# Altium schematic sheet LPEDT_revA1_bikeit_MCU_POWER_RESET.SchDoc: MCU Power and Reset Circuitry
size A3; Author: Dhruva Koley; DocumentNumber: 6; Revision: 1; SheetNumber: 3; SheetTotal: 4
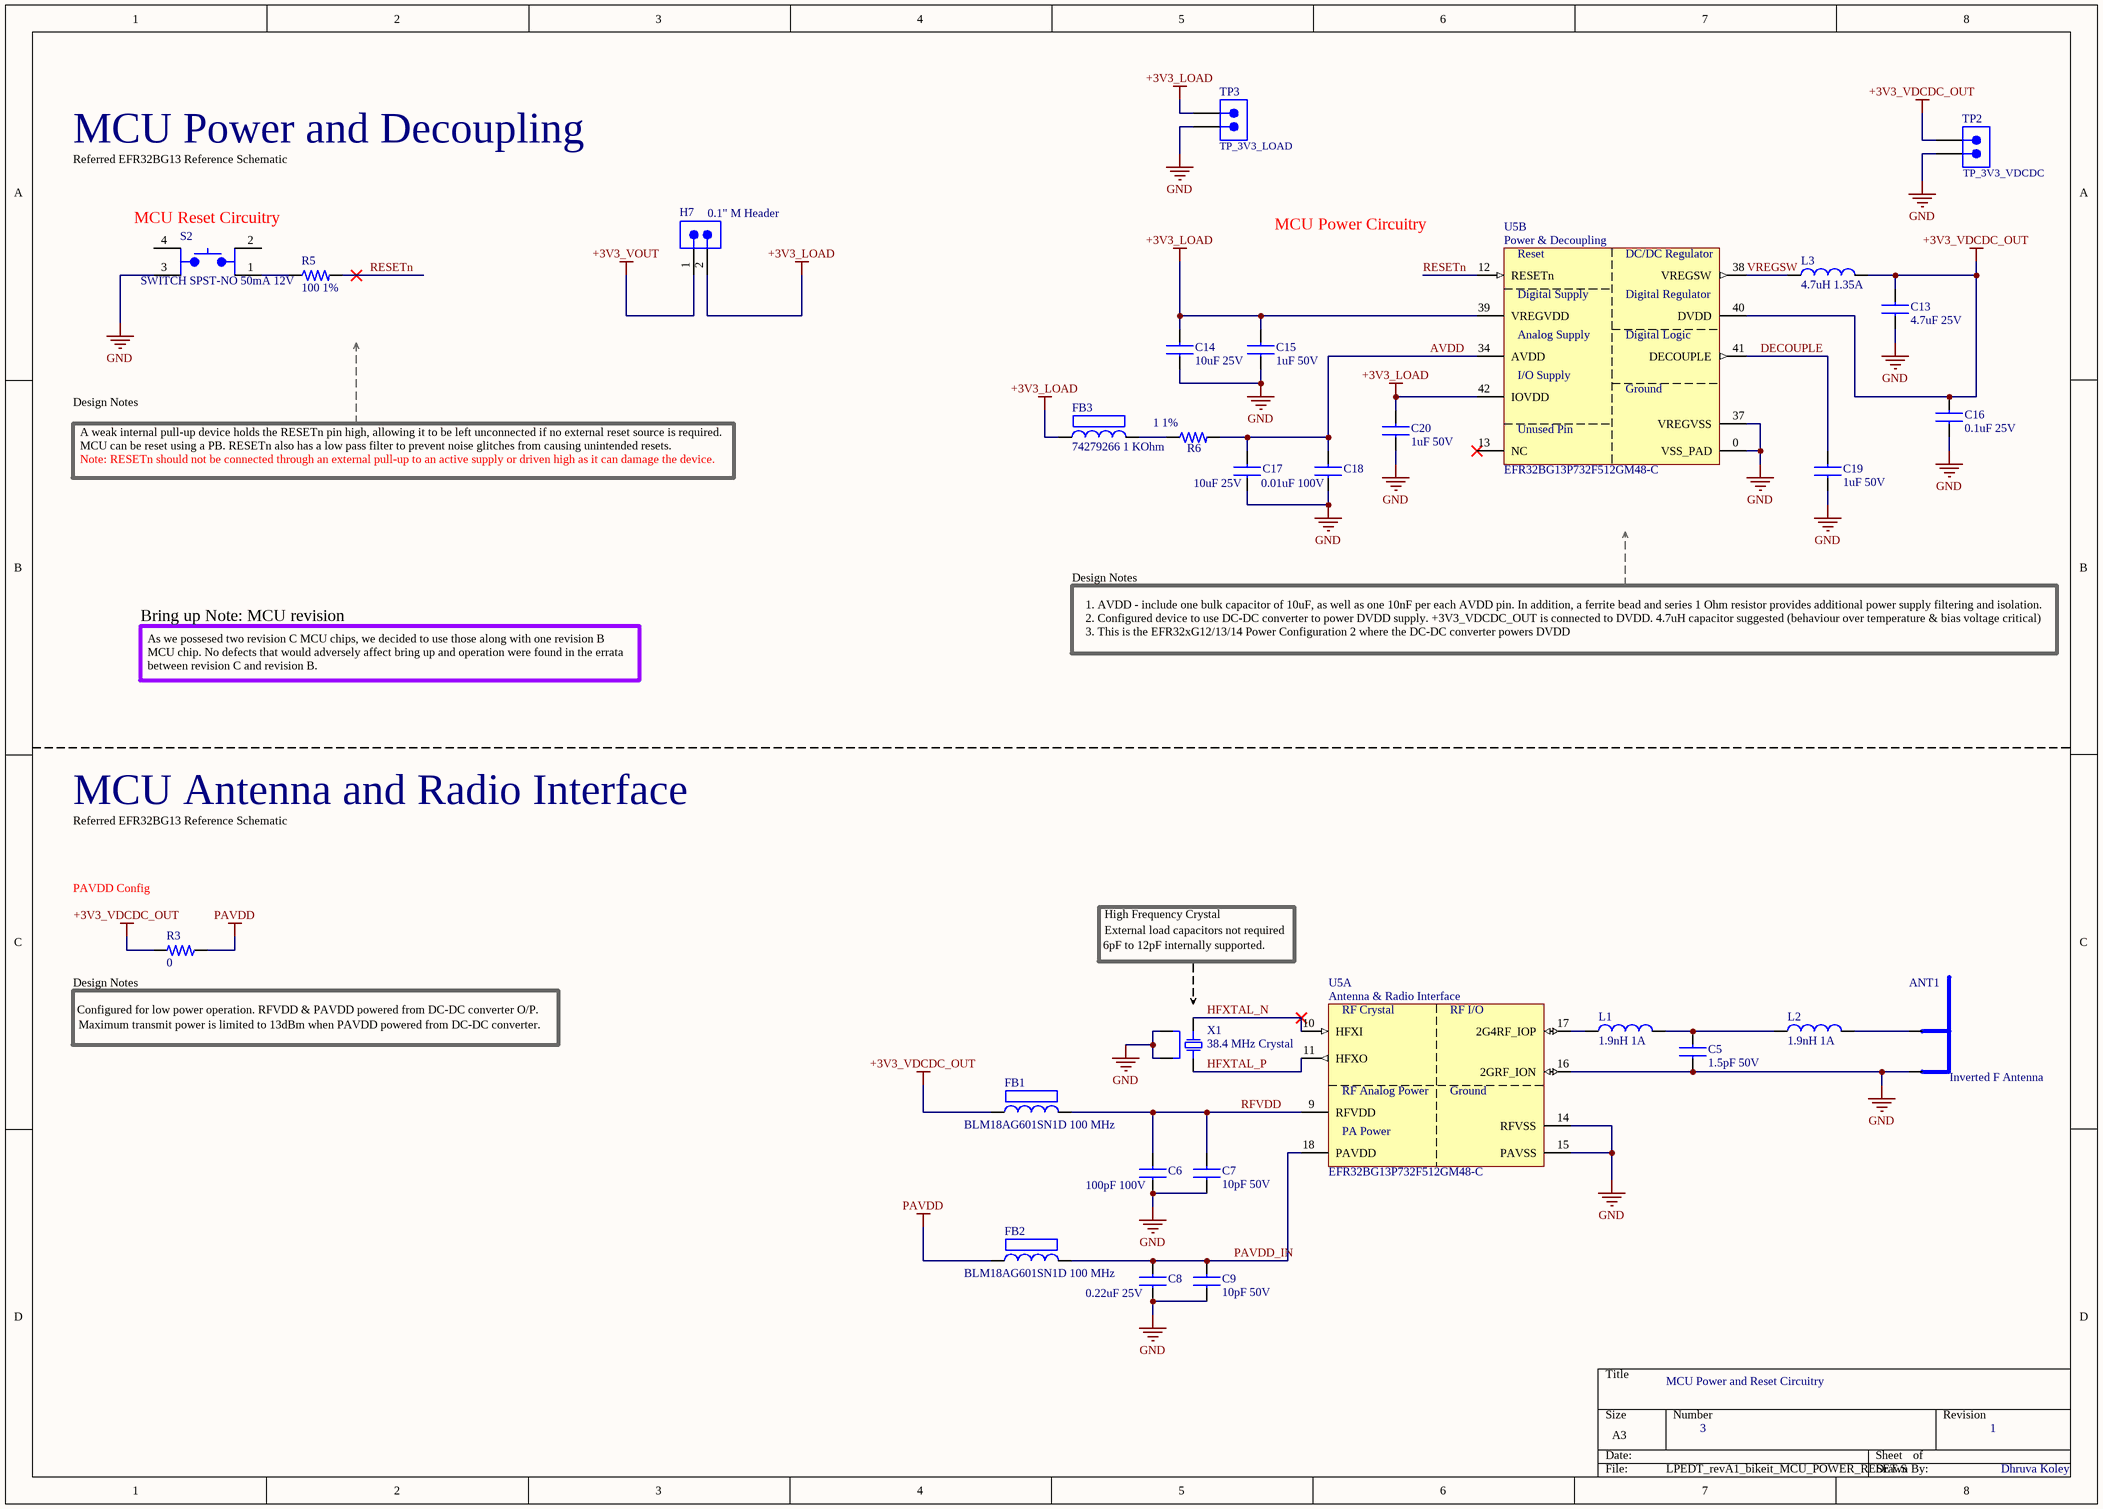
[diagram p0: LPEDT_revA1_bikeit_MCU_POWER_RESET.SchDoc]

## Parts
ANT1  Inverted F Antenna  [MIFA]  (net tie, no BOM)
C5  1.5pF 50V  [CAP_0403_1.00mm*0.50mm]
C6  100pF 100V  [CAP_0603_1.60mm*0.80mm]
C7  10pF 50V  [CAP_0603_1.60mm*0.80mm]
C8  0.22uF 25V  [CAP_0603_1.60mm*0.80mm]
C9  10pF 50V  [CAP_0603_1.60mm*0.80mm]
C13  4.7uF 25V  [CAP_0603_1.60mm*0.80mm]
C14  10uF 25V  [CAP_0805_2MM]
C15  1uF 50V  [CAP_0603_1.60mm*0.80mm]
C16  0.1uF 25V  [CAP_0603_1.60mm*0.80mm]
C17  10uF 25V  [CAP_0805_2MM]
C18  0.01uF 100V  [CAP_0603_1.60mm*0.80mm]
C19  1uF 50V  [CAP_0603_1.60mm*0.80mm]
C20  1uF 50V  [CAP_0603_1.60mm*0.80mm]
FB1  BLM18AG601SN1D 100 MHz  [FB_Chip2PinSM127P600-8N]
FB2  BLM18AG601SN1D 100 MHz  [FB_Chip2PinSM127P600-8N]
FB3  74279266 1 KOhm  [FB_0603_1.60mm*0.80mm]
H7  0.1" M Header  [2-PIN_MALE_HEADER_01-IN]
L1  1.9nH 1A  [IND_0402]
L2  1.9nH 1A  [IND_0402]
L3  4.7uH 1.35A  [IND_WE-TPC 2828]
R3  0  [RES_C1005X04N]
R5  100 1%  [RES_0603_1608X06]
R6  1 1%  [RES_0603_1608X06]
S2  SWITCH SPST-NO 50mA 12V  [SW_TL3305AF260QG]
TP2  TP_3V3_VDCDC  [TP10x_Probe]
TP3  TP_3V3_LOAD  [TP10x_Probe]
U5  EFR32BG13P732F512GM48-C  [MCU_QFN50P700X700X90_HS-49N]  (parts A,B of 3)
X1  38.4 MHz Crystal  [SMD_4 CRYSTAL]

## Nets
+3V3_LOAD: C14.1 C15.1 C20.1 FB3.1 H7.2 TP3.1(GND) U5.39(VREGVDD) U5.42(IOVDD)
+3V3_VDCDC_OUT: C13.1 C16.1 FB1.1 L3.2 R3.2 TP2.1(GND) U5.40(DVDD)
+3V3_VOUT: H7.1
GND: ANT1.GND C5.2 C6.2 C7.2 C8.2 C9.2 C13.2 C14.2 C15.2 C16.2 C17.2 C18.2 C19.2 C20.2 S2.3 TP2.2(SIG) TP3.2(SIG) U5.0(VSS_PAD) U5.14(RFVSS) U5.15(PAVSS) U5.16(2GRF_ION) U5.37(VREGVSS) X1.2(GND) X1.4(GND)
PAVDD: FB2.1 R3.1
AVDD: C17.1 C18.1 R6.2 U5.34(AVDD)
DECOUPLE: C19.1 U5.41(DECOUPLE)
HFXTAL_N: U5.10(HFXI) X1.3(HOT)
HFXTAL_P: U5.11(HFXO) X1.1(HOT)
PAVDD_IN: C8.1 C9.1 FB2.2 U5.18(PAVDD)
RESETn: R5.2 U5.12(RESETn)
RFVDD: C6.1 C7.1 FB1.2 U5.9(RFVDD)
VREGSW: L3.1 U5.38(VREGSW)
NetANT1_FEED: ANT1.FEED L2.2
NetC5_1: C5.1 L1.2 L2.1
NetFB3_2: FB3.2 R6.1
NetL1_1: L1.1 U5.17(2G4RF_IOP)
NetR5_1: R5.1 S2.1

Not connected (* = marked no-connect by the designer): S2 2 4; U5 13(NC)*

## Notes on the sheet
- MCU Power and Decoupling
- Referred EFR32BG13 Reference Schematic
- (near S2) MCU Reset Circuitry
- MCU Power Circuitry
- Design Notes
- A weak internal pull-up device holds the RESETn pin high, allowing it to be left unconnected if no external reset source is required.
- MCU can be reset using a PB. RESETn also has a low pass filter to prevent noise glitches from causing unintended resets.
- Note: RESETn should not be connected through an external pull-up to an active supply or driven high as it can damage the device.
- Bring up Note: MCU revision
- As we possesed two revision C MCU chips, we decided to use those along with one revision B
- 1. AVDD - include one bulk capacitor of 10uF, as well as one 10nF per each AVDD pin. In addition, a ferrite bead and series 1 Ohm resistor provides additional power supply filtering and isolation.
- 3. This is the EFR32xG12/13/14 Power Configuration 2 where the DC-DC converter powers DVDD
- 2. Configured device to use DC-DC converter to power DVDD supply. +3V3_VDCDC_OUT is connected to DVDD. 4.7uH capacitor suggested (behaviour over temperature & bias voltage critical)
- MCU chip. No defects that would adversely affect bring up and operation were found in the errata
- between revision C and revision B.
- MCU Antenna and Radio Interface
- PAVDD Config
- High Frequency Crystal
- (near R3) Design Notes
- 6pF to 12pF internally supported.
- External load capacitors not required
- Configured for low power operation. RFVDD & PAVDD powered from DC-DC converter O/P.
- Maximum transmit power is limited to 13dBm when PAVDD powered from DC-DC converter.
- (in symbol EFR32BG13P732F512GM48-C, part A) Antenna & Radio Interface; RF Crystal; RF I/O; RF Analog Power; Ground; PA Power
- (in symbol EFR32BG13P732F512GM48-C, part B) Power & Decoupling; Reset; DC/DC Regulator; Digital Supply; Digital Regulator; Analog Supply; Digital Logic; I/O Supply; Ground; Unused Pin

## Library data of the parts
ANT1 = Inverted F Antenna: Inverted F antenna for BT
C5 = 500R07S1R5BV4T: 1.5pF ±0.1pF 50V Ceramic Capacitor C0G, NP0 0402 (1005 Metric); Manufacturer: Johanson Technology Inc.; Manufacturer Part Number: 500R07S1R5BV4T; RoHS Compliant: Yes; Supplier 1: Digi-Key; Supplier Part Number 1: 712-1270-1-ND
C6 = GRM1885C2A101FA01D: Multilayer Ceramic Capacitors MLCC - SMD/SMT 100pF 100Volts C0G 0.01; Manufacturer: Murata; Tolerance: 1%; Manufacturer Part Number: GRM1885C2A101FA01D; RoHS: Yes; Category: Ceramic Capacitors; Stock 1: 40000; Pricing 1: 4000=0.03696, 8000=0.03511, 12000=0.03326, 28000=0.03142 (USD); Mount: Surface Mount; Case/Package: 0603; Case Code (Imperial): 0603; Case Code (Metric): 1608; Min Operating Temperature: -55°C; Max Operating Temperature: 125°C; Packaging: Tape and Reel; Package Quantity: 4000; Capacitance: 100pF; Voltage Rating: 100V; Dielectric: C0G; Voltage Rating (DC): 100V; Length: 1.6mm; Width: 0.031inch; Height: 0.8mm; Thickness: 0.035inch; Depth: 0.8mm; Radiation Hardening: No; ComponentLink1URL: https://datasheet.ciiva.com/29537/partnumbering-e-01-29537864.pdf?src-supplier=Digi-Key; ComponentLink1Description: https://datasheet.ciiva.com/29537/partnumbering-e-01-29537864.pdf?src-supplier=Digi-Key; Supplier 1: Digi-Key; Supplier Part Number 1: 490-14623-1-ND
C7 C9 = GRM1885C1H100FA01D: Cap Ceramic 10pF 50V C0G 1% SMD 0603 125C T/R; Manufacturer: Murata; Temperature Coefficient: 30ppm/°C; Supplier 1: Digi-Key; Manufacturer Part Number: GRM1885C1H100FA01D; RoHS: Yes; Category: Ceramic Capacitors; Stock 1: 160; Pricing 1: 1=0.15000, 10=0.11000, 50=0.06240, 100=0.05170 (USD); Mount: Surface Mount; Case/Package: 0603; Case Code (Metric): 1608; Case Code (Imperial): 0603; Material: Ceramic; Min Operating Temperature: -55°C; Max Operating Temperature: 125°C; Packaging: Tape and Reel; Capacitance: 10pF; Tolerance: 1%; Voltage Rating: 50V; Package Quantity: 4000; Voltage Rating (DC): 50V; Dielectric: C0G; Termination: SMD/SMT; Voltage: 50V; Series: GRM; Construction: Flat; Length: 1.6mm; Width: 0.8mm; Height: 0.8mm; Thickness: 0.035inch; Depth: 0.8mm; Radiation Hardening: No; Lead Free: Lead Free; RoHS Compliant: Yes; ComponentLink1URL: https://datasheet.ciiva.com/2989/c02e-2989424.pdf?src-supplier=Avnet; ComponentLink1Description: https://datasheet.ciiva.com/2989/c02e-2989424.pdf?src-supplier=Avnet; ComponentLink2URL: https://datasheet.ciiva.com/166/partnumbering-e-01-166098.pdf?src-supplier=Digi-Key; ComponentLink2Description: https://datasheet.ciiva.com/166/partnumbering-e-01-166098.pdf?src-supplier=Digi-Key; ComponentLink3URL: https://datasheet.ciiva.com/45259/partnumbering-e-01-45259517.pdf?src-supplier=Digi-Key; ComponentLink3Description: https://datasheet.ciiva.com/45259/partnumbering-e-01-45259517.pdf?src-supplier=Digi-Key; ComponentLink4URL: https://datasheet.ciiva.com/17453/c02e-17453134.pdf?src-supplier=Avnet+Europe; ComponentLink4Description: https://datasheet.ciiva.com/17453/c02e-17453134.pdf?src-supplier=Avnet+Europe; Supplier Part Number 1: 490-9713-1-ND
C8 = GRM188R71E224KA88D: Capacitor 220 nF 25 VDC PU=4000 ST, GRM188R71E224KA88D, Murata; Material: Ceramic; Capacitance: 220nF; Tolerance: 10%; Dielectric: X7R; Voltage: 50V; Supplier 1: Digi-Key; Manufacturer: Murata; Manufacturer Part Number: GRM188R71E224KA88D; RoHS: Yes; Category: Ceramic Capacitors; Stock 1: 208118; Pricing 1: 1=0.20000, 10=0.13700, 50=0.08240, 100=0.06960, 500=0.04760, 1000=0.04210 (USD); Mount: Surface Mount; Case/Package: 0603; Number of Pins: 2; Case Code (Imperial): 0603; Case Code (Metric): 1608; Min Operating Temperature: -55°C; Max Operating Temperature: 125°C; Voltage Rating: 25V; Voltage Rating (DC): 25V; Packaging: Tape and Reel; Package Quantity: 1; Termination: SMD/SMT; Length: 1.6mm; Width: 0.8mm; Height: 0.8mm; Thickness: 0.035inch; Depth: 0.8mm; Radiation Hardening: No; REACH SVHC: No SVHC; Lead Free: Lead Free; RoHS Compliant: Yes; ComponentLink1URL: https://datasheet.ciiva.com/5411/product-5411362.pdf?src-supplier=Mouser; ComponentLink1Description: https://datasheet.ciiva.com/5411/product-5411362.pdf?src-supplier=Mouser; ComponentLink2URL: https://datasheet.ciiva.com/11786/0900766b807a1cab-11786308.pdf?src-supplier=RSComponents; ComponentLink2Description: https://datasheet.ciiva.com/11786/0900766b807a1cab-11786308.pdf?src-supplier=RSComponents; ComponentLink3URL: https://datasheet.ciiva.com/6068/1784408-6068393.pdf?src-supplier=Farnell; ComponentLink3Description: https://datasheet.ciiva.com/6068/1784408-6068393.pdf?src-supplier=Farnell; ComponentLink4URL: https://datasheet.ciiva.com/133/grm188r71e224ka88-01-133883.pdf?src-supplier=Digi-Key; ComponentLink4Description: https://datasheet.ciiva.com/133/grm188r71e224ka88-01-133883.pdf?src-supplier=Digi-Key; ComponentLink5URL: https://datasheet.ciiva.com/133/grm188r71e224ka88-01-133884.pdf?src-supplier=Digi-Key; ComponentLink5Description: https://datasheet.ciiva.com/133/grm188r71e224ka88-01-133884.pdf?src-supplier=Digi-Key; ComponentLink6URL: https://datasheet.ciiva.com/3777/1531grm188r71e224ka8823-3777688.pdf?src-supplier=Arrow+Electronics; ComponentLink6Description: https://datasheet.ciiva.com/3777/1531grm188r71e224ka8823-3777688.pdf?src-supplier=Arrow+Electronics; ComponentLink7URL: https://datasheet.ciiva.com/29202/451619-da-01-en-vs-kondensator-0603-29202002.pdf?src-supplier=Conrad; ComponentLink7Description: https://datasheet.ciiva.com/29202/451619-da-01-en-vs-kondensator-0603-29202002.pdf?src-supplier=Conrad; ComponentLink8URL: https://datasheet.ciiva.com/14116/nmgrm-data-en-14116629.pdf?src-supplier=Distrelec; ComponentLink8Description: https://datasheet.ciiva.com/14116/nmgrm-data-en-14116629.pdf?src-supplier=Distrelec; ComponentLink9URL: https://datasheet.ciiva.com/16425/product-16425866.pdf?src-supplier=Future+Electronics; ComponentLink9Description: https://datasheet.ciiva.com/16425/product-16425866.pdf?src-supplier=Future+Electronics; ComponentLink10URL: https://datasheet.ciiva.com/22703/1784408-22703338.pdf?src-supplier=Element14; ComponentLink10Description: https://datasheet.ciiva.com/22703/1784408-22703338.pdf?src-supplier=Element14; ComponentLink11URL: https://datasheet.ciiva.com/7937/1784408-7937645.pdf?src-supplier=Element14; ComponentLink11Description: https://datasheet.ciiva.com/7937/1784408-7937645.pdf?src-supplier=Element14; ComponentLink12URL: https://datasheet.ciiva.com/48436/nmgrm-data-en-48436687.pdf?src-supplier=Distrelec; ComponentLink12Description: https://datasheet.ciiva.com/48436/nmgrm-data-en-48436687.pdf?src-supplier=Distrelec; Supplier Part Number 1: 490-3290-1-ND
C13 = GRM188R61E475KE11D: Cap Ceramic 0603 4.7 uF 25 V ±10 % Tolerance X5R SMT Multilayer Ceramic Capacitor; Manufacturer: Murata; Tolerance: 10%; Supplier 1: Digi-Key; Manufacturer Part Number: GRM188R61E475KE11D; RoHS: Yes; Category: Ceramic Capacitors; Stock 1: 307528; Pricing 1: 1=0.36000, 10=0.24700, 50=0.17280, 100=0.14820, 500=0.11112, 1000=0.09384 (USD); Mount: Surface Mount; Case/Package: 0603; Case Code (Metric): 1608; Case Code (Imperial): 0603; Material: Ceramic; Min Operating Temperature: -55°C; Max Operating Temperature: 85°C; Package Quantity: 4000; Packaging: Cut Tape; Capacitance: 4.7uF; Voltage Rating: 25V; Dielectric: X5R; Voltage: 25V; Voltage Rating (DC): 25V; Series: GRM; Length: 1.6mm; Width: 0.031inch; Height: 0.8mm; Thickness: 0.031inch; Depth: 0.8mm; REACH SVHC: No SVHC; Lead Free: Lead Free; RoHS Compliant: Yes; ComponentLink1URL: https://datasheet.ciiva.com/46444/1769893-46444982.pdf?src-supplier=Element14; ComponentLink1Description: https://datasheet.ciiva.com/46444/1769893-46444982.pdf?src-supplier=Element14; ComponentLink2URL: https://datasheet.ciiva.com/46444/1769893-46444983.pdf?src-supplier=Element14; ComponentLink2Description: https://datasheet.ciiva.com/46444/1769893-46444983.pdf?src-supplier=Element14; ComponentLink3URL: https://datasheet.ciiva.com/14891/partnumbering-e-01-14891103.pdf?src-supplier=Digi-Key; ComponentLink3Description: https://datasheet.ciiva.com/14891/partnumbering-e-01-14891103.pdf?src-supplier=Digi-Key; ComponentLink4URL: https://datasheet.ciiva.com/14891/partnumbering-e-01-14891102.pdf?src-supplier=Digi-Key; ComponentLink4Description: https://datasheet.ciiva.com/14891/partnumbering-e-01-14891102.pdf?src-supplier=Digi-Key; Supplier Part Number 1: 490-7203-1-ND
C14 C17 = GRM21BR61E106KA73K: CAP CER 10UF 25V X5R 0805; Manufacturer: Murata; Tolerance: 10%; Manufacturer Part Number: GRM21BR61E106KA73K; RoHS: Yes; Category: Ceramic Capacitors; Stock 1: 79269; Pricing 1: 1=0.23000, 10=0.15700, 50=0.09400, 100=0.07940, 500=0.05434, 1000=0.04807, 2500=0.04598, 5000=0.04180 (USD); Mount: Surface Mount; Case/Package: 0805; Weight: 0.000335oz; Min Operating Temperature: -55°C; Max Operating Temperature: 85°C; Packaging: Tape and Reel; Capacitance: 10uF; Voltage Rating: 25V; Package Quantity: 10000; Dielectric: X5R; Voltage Rating (DC): 25V; Length: 0.079inch; Width: 0.049inch; Thickness: 0.055inch; RoHS Compliant: Yes; ComponentLink1URL: http://www.mouser.com/ds/2/281/c02e-2905.pdf?src-supplier=Mouser; ComponentLink1Description: http://www.mouser.com/ds/2/281/c02e-2905.pdf?src-supplier=Mouser; ComponentLink2URL: http://search.murata.co.jp/Ceramy/image/img/A01X/G101/ENG/GRM21BR61E106KA73-01.pdf?src-supplier=Digi-Key; ComponentLink2Description: http://search.murata.co.jp/Ceramy/image/img/A01X/G101/ENG/GRM21BR61E106KA73-01.pdf?src-supplier=Digi-Key; ComponentLink3URL: https://search.murata.co.jp/Ceramy/image/img/A01X/G101/ENG/GRM21BR61E106KA73-01.pdf?src-supplier=Digi-Key; ComponentLink3Description: https://search.murata.co.jp/Ceramy/image/img/A01X/G101/ENG/GRM21BR61E106KA73-01.pdf?src-supplier=Digi-Key; Supplier 1: Digi-Key; Supplier Part Number 1: 490-16824-1-ND
C15 C19 C20 = GRT188R61H105KE13D: CAP, MLCC, AEC-Q200, X5R, 1uF, 50V, 0603; Manufacturer: Murata; Tolerance: 10%; Supplier 1: Digi-Key; Manufacturer Part Number: GRT188R61H105KE13D; RoHS: Yes; Category: Ceramic Capacitors; Stock 1: 645268; Pricing 1: 1=0.26000, 10=0.17900, 50=0.10720, 100=0.09060, 500=0.06198, 1000=0.05483 (USD); Mount: Surface Mount; Case/Package: 0603; Case Code (Metric): 1608; Case Code (Imperial): 0603; Min Operating Temperature: -55°C; Max Operating Temperature: 85°C; Packaging: Tape and Reel; Capacitance: 1uF; Voltage Rating: 50V; Dielectric: X5R; Voltage Rating (DC): 50V; Length: 0.063inch; Width: 0.031inch; Thickness: 0.035inch; Ratings: AEC-Q200; RoHS Compliant: Yes; ComponentLink1URL: http://www.farnell.com/datasheets/2165959.pdf?src-supplier=Farnell; ComponentLink1Description: http://www.farnell.com/datasheets/2165959.pdf?src-supplier=Farnell; ComponentLink2URL: http://search.murata.co.jp/Ceramy/image/img/A01X/G101/ENG/GRT188R61H105KE13-01.pdf?src-supplier=Digi-Key; ComponentLink2Description: http://search.murata.co.jp/Ceramy/image/img/A01X/G101/ENG/GRT188R61H105KE13-01.pdf?src-supplier=Digi-Key; ComponentLink3URL: https://search.murata.co.jp/Ceramy/image/img/A01X/G101/ENG/GRT188R61H105KE13-01.pdf?src-supplier=Digi-Key; ComponentLink3Description: https://search.murata.co.jp/Ceramy/image/img/A01X/G101/ENG/GRT188R61H105KE13-01.pdf?src-supplier=Digi-Key; ComponentLink4URL: http://www.farnell.com/datasheets/2165959.pdf?src-supplier=Newark; ComponentLink4Description: http://www.farnell.com/datasheets/2165959.pdf?src-supplier=Newark; Supplier Part Number 1: 490-12330-1-ND
C16 = GCJ188R71E104KA12D: CAP CER 0.1UF 25V X7R 0603; Manufacturer: Murata; Capacitance: 100nF; Tolerance: 10%; Supplier 1: Mouser; Manufacturer Part Number: GCJ188R71E104KA12D; RoHS: Yes; Category: Ceramic Capacitors; Stock 1: 1672; Pricing 1: 1=0.21000, 10=0.14900, 50=0.08480, 100=0.07030, 500=0.04928, 1000=0.04080 (USD); Mount: Surface Mount; Case/Package: 0603; Case Code (Imperial): 0603; Case Code (Metric): 1608; Min Operating Temperature: -55°C; Max Operating Temperature: 125°C; Features: Soft Termination; Packaging: Tape and Reel; Voltage Rating: 25V; Ratings: AEC-Q200; RoHS Compliant: Yes; ComponentLink1URL: http://search.murata.co.jp/Ceramy/image/img/A01X/G101/ENG/GCJ188R71E104KA12-01.pdf?src-supplier=Digi-Key; ComponentLink1Description: http://search.murata.co.jp/Ceramy/image/img/A01X/G101/ENG/GCJ188R71E104KA12-01.pdf?src-supplier=Digi-Key; Supplier Part Number 1: 81-GCJ188R71E104KA2D
C18 = GCM188R72A103KA37D: Multilayer Ceramic Capacitor, AEC-Q200 GCM Series, 0.01 F, 10%, X7R, 100 V RoHS Compliant: Yes; Manufacturer: Murata; Manufacturer Part Number: GCM188R72A103KA37J; Capacitance: 10nF; Supplier 1: Digi-Key; RoHS: Yes; Category: Ceramic Capacitors; Stock 1: 112779; Pricing 1: 1=0.10000, 10=0.07400, 50=0.04060, 100=0.03310, 500=0.02364, 1000=0.01857 (USD); Mount: Surface Mount; Case/Package: 0603; Case Code (Imperial): 0603; Case Code (Metric): 1608; Min Operating Temperature: -55°C; Max Operating Temperature: 125°C; Tolerance: 10%; Voltage Rating: 100V; Packaging: Tape and Reel; Voltage Rating (DC): 100V; Package Quantity: 1; Dielectric: X7R; Termination: SMD/SMT; Voltage: 100V; Series: GCM; Construction: Flat; Length: 1.6mm; Width: 0.8mm; Height: 0.8mm; Thickness: 0.035inch; Depth: 0.8mm; Ratings: AEC-Q200; Radiation Hardening: No; REACH SVHC: No SVHC; Lead Free: Lead Free; RoHS Compliant: Yes; ComponentLink1URL: https://datasheet.ciiva.com/132/product-132907.pdf?src-supplier=Digi-Key; ComponentLink1Description: https://datasheet.ciiva.com/132/product-132907.pdf?src-supplier=Digi-Key; ComponentLink2URL: https://datasheet.ciiva.com/132/product-132909.pdf?src-supplier=Digi-Key; ComponentLink2Description: https://datasheet.ciiva.com/132/product-132909.pdf?src-supplier=Digi-Key; ComponentLink3URL: https://datasheet.ciiva.com/16497/product-16497251.pdf?src-supplier=Future+Electronics; ComponentLink3Description: https://datasheet.ciiva.com/16497/product-16497251.pdf?src-supplier=Future+Electronics; ComponentLink4URL: https://datasheet.ciiva.com/18183/getdatasheetpartid-178890-18183651.pdf?src-supplier=Verical; ComponentLink4Description: https://datasheet.ciiva.com/18183/getdatasheetpartid-178890-18183651.pdf?src-supplier=Verical; ComponentLink5URL: https://datasheet.ciiva.com/132/product-132908.pdf?src-supplier=Digi-Key; ComponentLink5Description: https://datasheet.ciiva.com/132/product-132908.pdf?src-supplier=Digi-Key; ComponentLink6URL: https://datasheet.ciiva.com/11786/0900766b80ef92d0-11786108.pdf?src-supplier=RSComponents; ComponentLink6Description: https://datasheet.ciiva.com/11786/0900766b80ef92d0-11786108.pdf?src-supplier=RSComponents; ComponentLink7URL: https://datasheet.ciiva.com/11619/product-11619719.pdf?src-supplier=Avnet; ComponentLink7Description: https://datasheet.ciiva.com/11619/product-11619719.pdf?src-supplier=Avnet; Supplier Part Number 1: 490-8028-1-ND
FB1 FB2 = BLM18AG601SN1D: Ferrite Bead, 0603 / 1608, 600 ohm, 500 mA, Série BLM18A, 0.38 ohm, ± 25%; Manufacturer: Murata; Material: Steel,Ferrite; Frequency: 100MHz; Impedance: 600R; Max Current Rating: 500mA; Number of Lines: 1; DC Resistance (DCR): 380mR; Shielding: Unshielded; Supplier 1: Digi-Key; Manufacturer Part Number: BLM18AG601SN1D; RoHS: Yes; Category: Inductors; Stock 1: 826617; Pricing 1: 1=0.10000, 10=0.07200, 25=0.06560, 50=0.05900, 100=0.04320, 250=0.03144, 500=0.02882, 1000=0.02489 (USD); Case/Package: 0603; Number of Pins: 2; Core Material: Ferrite; Case Code (Metric): 1608; Case Code (Imperial): 0603; Weight: 7.1E-05oz; Min Operating Temperature: -55°C; Max Operating Temperature: 125°C; Package Quantity: 1; Packaging: Tape and Reel; Tolerance: 25%; Current Rating: 500mA; Termination: SMD/SMT; Max DC Current: 500mA; Test Frequency: 100MHz; DC Current: 500mA; Number of Circuits: 1; Length: 1.6mm; Width: 0.8mm; Height: 0.8mm; Depth: 0.8mm; Radiation Hardening: No; RoHS Compliant: Yes; Lead Free: Lead Free; REACH SVHC: No SVHC; Military Standard: Not; ComponentLink1URL: https://datasheet.ciiva.com/19460/1844766-19460213.pdf?src-supplier=Jameco; ComponentLink1Description: https://datasheet.ciiva.com/19460/1844766-19460213.pdf?src-supplier=Jameco; ComponentLink2URL: https://datasheet.ciiva.com/29347/442309-da-01-en-chip-drossel-0603-600r-500ma-1-6x0-8mm-29347900.pdf?src-supplier=Conrad; ComponentLink2Description: https://datasheet.ciiva.com/29347/442309-da-01-en-chip-drossel-0603-600r-500ma-1-6x0-8mm-29347900.pdf?src-supplier=Conrad; ComponentLink3URL: https://datasheet.ciiva.com/41449/001172228-da-01-en-drossel-0603-600r-1-6x0-8mm-4000st-41449517.pdf?src-supplier=Conrad; ComponentLink3Description: https://datasheet.ciiva.com/41449/001172228-da-01-en-drossel-0603-600r-1-6x0-8mm-4000st-41449517.pdf?src-supplier=Conrad; ComponentLink4URL: https://datasheet.ciiva.com/1012/l0110s0100blm18a-1012017.pdf?src-supplier=Digi-Key; ComponentLink4Description: https://datasheet.ciiva.com/1012/l0110s0100blm18a-1012017.pdf?src-supplier=Digi-Key; ComponentLink5URL: https://datasheet.ciiva.com/1012/l0110s0100blm18a-1012018.pdf?src-supplier=Digi-Key; ComponentLink5Description: https://datasheet.ciiva.com/1012/l0110s0100blm18a-1012018.pdf?src-supplier=Digi-Key; ComponentLink6URL: https://datasheet.ciiva.com/1012/l0110s0100blm18a-1012019.pdf?src-supplier=Digi-Key; ComponentLink6Description: https://datasheet.ciiva.com/1012/l0110s0100blm18a-1012019.pdf?src-supplier=Digi-Key; ComponentLink7URL: https://datasheet.ciiva.com/1466/1756147-1466933.pdf?src-supplier=Element14; ComponentLink7Description: https://datasheet.ciiva.com/1466/1756147-1466933.pdf?src-supplier=Element14; ComponentLink8URL: https://datasheet.ciiva.com/1466/1756147-1466934.pdf?src-supplier=Element14; ComponentLink8Description: https://datasheet.ciiva.com/1466/1756147-1466934.pdf?src-supplier=Element14; ComponentLink9URL: https://datasheet.ciiva.com/16210/l0110s0100blm18a-16210006.pdf?src-supplier=Future+Electronics; ComponentLink9Description: https://datasheet.ciiva.com/16210/l0110s0100blm18a-16210006.pdf?src-supplier=Future+Electronics; ComponentLink10URL: https://datasheet.ciiva.com/3081/l0110s0100blm18a-3081613.pdf?src-supplier=Avnet; ComponentLink10Description: https://datasheet.ciiva.com/3081/l0110s0100blm18a-3081613.pdf?src-supplier=Avnet; Supplier Part Number 1: 490-1014-1-ND
FB3 = 74279266: Ferrite Bead, 0603 [1608 Metric], 1 kohm, 200 mA, WE-CBF Series, 0.6 ohm, ± 25%; Manufacturer: Wurth Electronics; Impedance: 1kR; Current Rating: 200mA; DC Resistance (DCR): 600mR; Test Frequency: 100MHz; Inductance: 1.8nH; Shielding: Unshielded; Number of Lines: 1; Supplier 1: Digi-Key; Manufacturer Part Number: 74279266; RoHS: Yes; Category: Ferrite Beads and Chips; Stock 1: 55585; Pricing 1: 1=0.17000, 50=0.16800, 100=0.15500, 500=0.14800, 1000=0.14100, 2000=0.13400 (USD); Case/Package: SMD/SMT; Case Code (Metric): 1608; Case Code (Imperial): 0603; Core Material: Ferrite; Min Operating Temperature: -55°C; Max Operating Temperature: 125°C; Tolerance: 25%; Packaging: Tape and Reel; Series: WE-CBF; Max DC Current: 200mA; Termination: SMD/SMT; Max Current Rating: 200mA; Length: 1.6mm; Width: 0.8mm; Height: 0.8mm; Depth: 0.8mm; REACH SVHC: Unknown; Lead Free: Lead Free; RoHS Compliant: Yes; ComponentLink1URL: https://datasheet.ciiva.com/14634/0900766b801ef1d0-14634816.pdf?src-supplier=Allied+Electronics; ComponentLink1Description: https://datasheet.ciiva.com/14634/0900766b801ef1d0-14634816.pdf?src-supplier=Allied+Electronics; ComponentLink2URL: https://datasheet.ciiva.com/23763/74279266-23763009.pdf?src-supplier=Newark; ComponentLink2Description: https://datasheet.ciiva.com/23763/74279266-23763009.pdf?src-supplier=Newark; ComponentLink3URL: https://datasheet.ciiva.com/11799/0900766b801ef1d0-11799352.pdf?src-supplier=RSComponents; ComponentLink3Description: https://datasheet.ciiva.com/11799/0900766b801ef1d0-11799352.pdf?src-supplier=RSComponents; ComponentLink4URL: https://datasheet.ciiva.com/14971/74279266-14971192.pdf?src-supplier=Digi-Key; ComponentLink4Description: https://datasheet.ciiva.com/14971/74279266-14971192.pdf?src-supplier=Digi-Key; ComponentLink5URL: https://datasheet.ciiva.com/12395/74279266-221135-12395453.pdf?src-supplier=Mouser; ComponentLink5Description: https://datasheet.ciiva.com/12395/74279266-221135-12395453.pdf?src-supplier=Mouser; ComponentLink6URL: https://datasheet.ciiva.com/1466/1705901-1466509.pdf?src-supplier=Element14; ComponentLink6Description: https://datasheet.ciiva.com/1466/1705901-1466509.pdf?src-supplier=Element14; ComponentLink7URL: https://datasheet.ciiva.com/22711/1705901-22711422.pdf?src-supplier=Element14; ComponentLink7Description: https://datasheet.ciiva.com/22711/1705901-22711422.pdf?src-supplier=Element14; ComponentLink8URL: https://datasheet.ciiva.com/48698/001087059-da-01-ml-we-cbf-smd-ferrit-74279266-de-en-48698427.pdf?src-supplier=Conrad; ComponentLink8Description: https://datasheet.ciiva.com/48698/001087059-da-01-ml-we-cbf-smd-ferrit-74279266-de-en-48698427.pdf?src-supplier=Conrad; Supplier Part Number 1: 732-4484-1-ND
H7 = PRPC002SAAN-RC: CONN HEADER VERT 2POS 2.54MM; Manufacturer: Sullins; Connector Type: Header, Unshrouded, Breakaway; Number of Positions: 2; Number of Positions Loaded: All; Pitch: 0.100" (2.54mm); Online Catalog: 0.100" (2.54mm) Pitch Connector Headers; Other Names: S9510E-02  S9510E-02-ND; Supplier 1: Digi-Key; Manufacturer Part Number: PRPC002SAAN-RC; Stock 1: 42739; Pricing 1: 1=0.08, 10=0.073, 25=0.054, 50=0.0464, 100=0.0449, 250=0.0387, 500=0.0372 (USD); Standard Package: 1; Category: Connectors, Interconnects; Family: Rectangular Connectors - Headers, Male Pins; Series: -; Packaging: Bulk; Contact Type: Male Pin; Number of Rows: 1; Row Spacing: -; Contact Mating Length: 0.230" (5.84mm); Mounting Type: Through Hole; Termination: Solder; Fastening Type: -; Features: -; Contact Finish: Gold; Contact Finish Thickness: Flash; Color: Black; ComponentLink1URL: https://media.digikey.com/PDF/Data%20Sheets/Sullins%20PDFs/xRxCzzzSxxN-RC_ST_11635-B.pdf?src-supplier=Digi-Key; ComponentLink1Description: https://media.digikey.com/PDF/Data%20Sheets/Sullins%20PDFs/xRxCzzzSxxN-RC_ST_11635-B.pdf?src-supplier=Digi-Key; Supplier Part Number 1: S1011EC-02-ND
L1 L2 = LQG15WZ1N9S02D: 1.9nH Unshielded Multilayer Inductor 1A 50mOhm Max 0402 (1005 Metric); RoHS: No; Category: Fixed Inductors; Supplier 1: Digi-Key; Supplier Part Number 1: 490-LQG15WZ1N9S02DCT-ND
L3 = 744025004: Fixed Inductors WE-TPC 2828 4.7uH 1.35A .1Ohm; Manufacturer: Wurth Electronics; Core Material: Ferrite; Tolerance: 20%; Saturation Current: 1.7A; Shielding: Shielded; Self Resonant Frequency: 84MHz; DC Resistance (DCR): 120mR; Test Frequency: 100kHz; Series Resistance: 100mR; Supplier 1: Digi-Key; Manufacturer Part Number: 744025004; RoHS: Yes; Category: Fixed Inductors; Stock 1: 11294; Pricing 1: 1=1.54000, 10=1.48000, 50=1.36000, 100=1.13000, 250=1.02000 (USD); Mount: Surface Mount; Case/Package: Nonstandard; Number of Pins: 2; Min Operating Temperature: -40°C; Max Operating Temperature: 125°C; Packaging: Cut Tape; Package Quantity: 550; Resistor Type: Wirewound; Current Rating: 1.35A; Inductance: 4.7uH; Inductance Tolerance: 20%; Max DC Current: 1.35A; Termination: SMD/SMT; RMS Current (Irms): 1.35A; Length: 2.8mm; Width: 0.11inch; Height: 2.8mm; Height - Seated (Max): 0.118inch; Depth: 2.8mm; REACH SVHC: Unknown; ComponentLink1URL: https://datasheet.ciiva.com/6690/744025004-6690389.pdf?src-supplier=Digi-Key; ComponentLink1Description: https://datasheet.ciiva.com/6690/744025004-6690389.pdf?src-supplier=Digi-Key; ComponentLink2URL: https://datasheet.ciiva.com/11803/0900766b80f886b6-11803593.pdf?src-supplier=RSComponents; ComponentLink2Description: https://datasheet.ciiva.com/11803/0900766b80f886b6-11803593.pdf?src-supplier=RSComponents; ComponentLink3URL: https://datasheet.ciiva.com/4954/744025004-76625-4954718.pdf?src-supplier=Mouser; ComponentLink3Description: https://datasheet.ciiva.com/4954/744025004-76625-4954718.pdf?src-supplier=Mouser; ComponentLink4URL: https://datasheet.ciiva.com/6690/744025004-6690390.pdf?src-supplier=Digi-Key; ComponentLink4Description: https://datasheet.ciiva.com/6690/744025004-6690390.pdf?src-supplier=Digi-Key; ComponentLink5URL: https://datasheet.ciiva.com/14123/744025004-eng-tds-14123830.pdf?src-supplier=Distrelec; ComponentLink5Description: https://datasheet.ciiva.com/14123/744025004-eng-tds-14123830.pdf?src-supplier=Distrelec; ComponentLink6URL: https://datasheet.ciiva.com/6690/744025004-6690391.pdf?src-supplier=Digi-Key; ComponentLink6Description: https://datasheet.ciiva.com/6690/744025004-6690391.pdf?src-supplier=Digi-Key; ComponentLink7URL: https://datasheet.ciiva.com/7650/1243426-7650570.pdf?src-supplier=Element14; ComponentLink7Description: https://datasheet.ciiva.com/7650/1243426-7650570.pdf?src-supplier=Element14; Supplier Part Number 1: 732-2615-1-ND
R3 = RMCF0402ZT0R00: RES SMD 0 OHM JUMPER 1/16W 0402; Manufacturer: Stackpole Electronics; Resistance: 0R; Power Rating: 63mW; Current Rating: 1A; Working Voltage: 50V; Supplier 1: Digi-Key; Manufacturer Part Number: RMCF0402ZT0R00; RoHS: Yes; Category: Chip SMD Resistors; Stock 1: 5982991; Pricing 1: 1=0.10000, 10=0.01000, 25=0.00720, 50=0.00560, 100=0.00410, 250=0.00316, 500=0.00252, 1000=0.00186, 5000=0.00133 (USD); Mount: Surface Mount; Case/Package: 0402; Case Code (Metric): 1005; Case Code (Imperial): 0402; Contact Plating: Tin,Matte; Min Operating Temperature: -55°C; Max Operating Temperature: 155°C; Packaging: Tape and Reel; Resistor Type: Thick Film; Number of Terminations: 2; Max Power Dissipation: 63mW; Features: Automotive AEC-Q200; Series: RMCF; Technology: THICK FILM; Construction: Rectangular; Length: 0.039inch; Width: 0.02inch; Height: 0.016inch; Depth: 0.5mm; Radiation Hardening: No; Military Standard: Not; Lead Free: Lead Free; RoHS Compliant: Yes; ComponentLink1URL: https://datasheet.ciiva.com/26835/getdatasheetpartid-409751-26835612.pdf?src-supplier=Verical; ComponentLink1Description: https://datasheet.ciiva.com/26835/getdatasheetpartid-409751-26835612.pdf?src-supplier=Verical
R5 = RMCF0603FT100R: RES SMD 100 1%; Manufacturer: Stackpole Electronics; Resistance: 100R; Power Rating: 100mW; Temperature Coefficient: 100ppm/°C; Supplier 1: Digi-Key; Manufacturer Part Number: RMCF0603FT100R; RoHS: Yes; Category: Chip SMD Resistors; Stock 1: 1363320; Pricing 1: 1=0.10000, 10=0.01600, 100=0.00650, 1000=0.00292, 2500=0.00253 (USD); Mount: Surface Mount; Case/Package: 0603; Case Code (Metric): 1608; Case Code (Imperial): 0603; Contact Plating: Tin,Matte; Size Code: 0603; Min Operating Temperature: -55°C; Max Operating Temperature: 155°C; Tolerance: 1%; Packaging: Tape and Reel; Resistor Type: Thick Film; Number of Terminations: 2; Max Power Dissipation: 100mW; Features: Automotive AEC-Q200; Series: RMCF; Construction: Rectangular; Length: 1.55mm; Width: 0.031inch; Height: 0.022inch; Depth: 0.8mm; Radiation Hardening: No; Military Standard: Not; Lead Free: Lead Free; RoHS Compliant: Yes; ComponentLink1URL: https://datasheet.ciiva.com/15215/getdatasheetpartid-360413-15215981.pdf?src-supplier=Verical; ComponentLink1Description: https://datasheet.ciiva.com/15215/getdatasheetpartid-360413-15215981.pdf?src-supplier=Verical; Supplier Part Number 1: RMCF0603FT100RCT-ND
R6 = ERJ-3RQF1R0V: RES SMD 1 OHM 1% 1/10W 0603; Manufacturer: Panasonic; Resistance: 1R; Power Rating: 100mW; Temperature Coefficient: 200ppm/°C; Supplier 1: Digi-Key; Manufacturer Part Number: ERJ-3RQF1R0V; RoHS: Yes; Category: Chip SMD Resistors; Stock 1: 151763; Pricing 1: 1=0.16000, 10=0.13600, 25=0.09920, 50=0.07200, 100=0.05330, 250=0.04092, 500=0.03224, 1000=0.02232 (USD); Mount: Surface Mount; Case/Package: 0603; Number of Pins: 2; Case Code (Imperial): 0603; Case Code (Metric): 1608; Contact Plating: Tin; Weight: 7.1E-05oz; Size Code: 0603; Min Operating Temperature: -55°C; Max Operating Temperature: 125°C; Tolerance: 1%; Packaging: Tape and Reel; Package Quantity: 5000; Termination: SMD/SMT; Resistor Type: Thick Film; Number of Terminations: 2; Max Power Dissipation: 100mW; Technology: THICK FILM; Series: ERJ; Construction: Rectangular; Resistance Tolerance: 1%; Length: 1.6mm; Width: 0.8mm; Height: 0.45mm; Depth: 0.8mm; Radiation Hardening: No; REACH SVHC: No SVHC; Military Standard: Not; Lead Free: Lead Free; RoHS Compliant: Yes; ComponentLink1URL: https://datasheet.ciiva.com/11810/0900766b80eefa12-11810728.pdf?src-supplier=RSComponents; ComponentLink1Description: https://datasheet.ciiva.com/11810/0900766b80eefa12-11810728.pdf?src-supplier=RSComponents; ComponentLink2URL: https://datasheet.ciiva.com/16396/aoa0000ce3-16396837.pdf?src-supplier=Future+Electronics; ComponentLink2Description: https://datasheet.ciiva.com/16396/aoa0000ce3-16396837.pdf?src-supplier=Future+Electronics; ComponentLink3URL: https://datasheet.ciiva.com/28691/391509-28691973.pdf?src-supplier=Element14; ComponentLink3Description: https://datasheet.ciiva.com/28691/391509-28691973.pdf?src-supplier=Element14; ComponentLink4URL: https://datasheet.ciiva.com/16784/70068852-16784839.pdf?src-supplier=Allied+Electronics; ComponentLink4Description: https://datasheet.ciiva.com/16784/70068852-16784839.pdf?src-supplier=Allied+Electronics; ComponentLink5URL: https://datasheet.ciiva.com/9117/aoa0000ce3-9117368.pdf?src-supplier=Avnet; ComponentLink5Description: https://datasheet.ciiva.com/9117/aoa0000ce3-9117368.pdf?src-supplier=Avnet; ComponentLink6URL: https://datasheet.ciiva.com/24165/aoa0000ce3-72189-24165336.pdf?src-supplier=Mouser; ComponentLink6Description: https://datasheet.ciiva.com/24165/aoa0000ce3-72189-24165336.pdf?src-supplier=Mouser; ComponentLink7URL: https://datasheet.ciiva.com/30060/6aoa0000ce3-30060648.pdf?src-supplier=Onlinecomponents.com; ComponentLink7Description: https://datasheet.ciiva.com/30060/6aoa0000ce3-30060648.pdf?src-supplier=Onlinecomponents.com; ComponentLink8URL: https://datasheet.ciiva.com/6138/391509-6138777.pdf?src-supplier=Farnell; ComponentLink8Description: https://datasheet.ciiva.com/6138/391509-6138777.pdf?src-supplier=Farnell; ComponentLink9URL: https://datasheet.ciiva.com/16766/70068852-16766778.pdf?src-supplier=Allied+Electronics; ComponentLink9Description: https://datasheet.ciiva.com/16766/70068852-16766778.pdf?src-supplier=Allied+Electronics; ComponentLink10URL: https://datasheet.ciiva.com/16853/aoa0000ce3-16853436.pdf?src-supplier=Avnet+Europe; ComponentLink10Description: https://datasheet.ciiva.com/16853/aoa0000ce3-16853436.pdf?src-supplier=Avnet+Europe; ComponentLink11URL: https://datasheet.ciiva.com/43455/391509-43455868.pdf?src-supplier=Farnell; ComponentLink11Description: https://datasheet.ciiva.com/43455/391509-43455868.pdf?src-supplier=Farnell; ComponentLink12URL: https://datasheet.ciiva.com/28547/391509-28547230.pdf?src-supplier=Element14; ComponentLink12Description: https://datasheet.ciiva.com/28547/391509-28547230.pdf?src-supplier=Element14; Supplier Part Number 1: P1.0AJCT-ND
S2 = TL3305AF260QG: SWITCH TACTILE SPST-NO 50MA 12V; Manufacturer: E-Switch; Mechanical Life: 200000Cycles; Throw Configuration: SPST; Illumination Type: Non-Illuminated; Operating Force: 260gf; Switch Function: Off-Mom; Actuator Type: Standard; Switch Travel: 0.2mm; Manufacturer Part Number: TL3305AF260QG; RoHS: No; Category: Tactile Switches; Stock 1: 70002; Pricing 1: 1=0.18000, 10=0.17700, 25=0.16760, 100=0.15250, 250=0.14336, 500=0.13116, 1000=0.10980 (USD); Mount: Surface Mount; Min Operating Temperature: -20°C; Max Operating Temperature: 70°C; Packaging: Tape and Reel; Termination: Gull Wing; Lead Free: Lead Free; ComponentLink1URL: http://www.farnell.com/datasheets/2554191.pdf?src-supplier=Farnell; ComponentLink1Description: http://www.farnell.com/datasheets/2554191.pdf?src-supplier=Farnell; ComponentLink2URL: http://www.farnell.com/datasheets/2554191.pdf?src-supplier=Newark; ComponentLink2Description: http://www.farnell.com/datasheets/2554191.pdf?src-supplier=Newark; ComponentLink3URL: http://www.farnell.com/datasheets/2554191.pdf?src-supplier=Element14; ComponentLink3Description: http://www.farnell.com/datasheets/2554191.pdf?src-supplier=Element14; ComponentLink4URL: http://spec_sheets.e-switch.com/specs/P010471.pdf?src-supplier=Digi-Key; ComponentLink4Description: http://spec_sheets.e-switch.com/specs/P010471.pdf?src-supplier=Digi-Key; ComponentLink5URL: http://spec_sheets.e-switch.com/specs/P010471.pdf?src-supplier=Mouser; ComponentLink5Description: http://spec_sheets.e-switch.com/specs/P010471.pdf?src-supplier=Mouser; ComponentLink6URL: http://spec_sheets.e-switch.com/specs/P010471.pdf?src-supplier=NAC+Semi; ComponentLink6Description: http://spec_sheets.e-switch.com/specs/P010471.pdf?src-supplier=NAC+Semi; Supplier 1: Digi-Key; Supplier Part Number 1: EG5353CT-ND
TP2 TP3 = Test Point
U5 = EFR32BG13P732F512GM48-C: BLUE GECKO QFN48 2.4 GHZ 512KB 6; Manufacturer: Silicon Labs; Supplier 1: Digi-Key; Manufacturer Part Number: EFR32BG13P732F512GM48-C; RoHS: No; Category: RF Receivers, Transceivers; Pricing 1: 1=7.61000, 10=6.79200, 25=6.11320, 80=5.56988, 230=5.02643, 440=4.51023, 945=3.80380 (USD); ComponentLink1URL: http://www.farnell.com/datasheets/2813683.pdf?src-supplier=Farnell; ComponentLink1Description: http://www.farnell.com/datasheets/2813683.pdf?src-supplier=Farnell; Supplier Part Number 1: 336-4109-ND
X1 = CX2016DB38400D0FLJCC: CRYSTAL 38.4000MHZ 8PF SMD; Manufacturer: Kyocera AVX; Tolerance: 10ppm; ESR (Equivalent Series Resistance): 60R; Frequency Stability: 15ppm; Supplier 1: Digi-Key; Manufacturer Part Number: CX2016DB38400D0FLJCC; RoHS: Yes; Category: Crystals; Stock 1: 63853; Pricing 1: 1=0.65000, 10=0.57500, 50=0.53760, 100=0.47500, 500=0.45000, 1000=0.37500 (USD); Mount: Surface Mount; Case/Package: SMD/SMT; Min Operating Temperature: -30°C; Max Operating Temperature: 85°C; Frequency: 38.4MHz; Load Capacitance: 8pF; Packaging: Tape and Reel; Package Quantity: 3000; Frequency Tolerance: 10ppm; Termination: SMD/SMT; Length: 0.079inch; Width: 1.6mm; Height: 0.018inch; Lead Pitch: 1.4mm; ComponentLink1URL: https://datasheet.ciiva.com/26992/cx2016db-cs-e-26992341.pdf?src-supplier=Mouser; ComponentLink1Description: https://datasheet.ciiva.com/26992/cx2016db-cs-e-26992341.pdf?src-supplier=Mouser; ComponentLink2URL: https://datasheet.ciiva.com/29631/cx2016db-wl-e-29631639.pdf?src-supplier=Digi-Key; ComponentLink2Description: https://datasheet.ciiva.com/29631/cx2016db-wl-e-29631639.pdf?src-supplier=Digi-Key; ComponentLink3URL: https://datasheet.ciiva.com/29631/cx2016db-wl-e-29631640.pdf?src-supplier=Digi-Key; ComponentLink3Description: https://datasheet.ciiva.com/29631/cx2016db-wl-e-29631640.pdf?src-supplier=Digi-Key; ComponentLink4URL: https://datasheet.ciiva.com/29631/cx2016db-wl-e-29631641.pdf?src-supplier=Digi-Key; ComponentLink4Description: https://datasheet.ciiva.com/29631/cx2016db-wl-e-29631641.pdf?src-supplier=Digi-Key; Supplier Part Number 1: 1253-1119-1-ND